# Altium schematic sheet POW.SchDoc
size A4; SheetNumber: 1; SheetTotal: 2
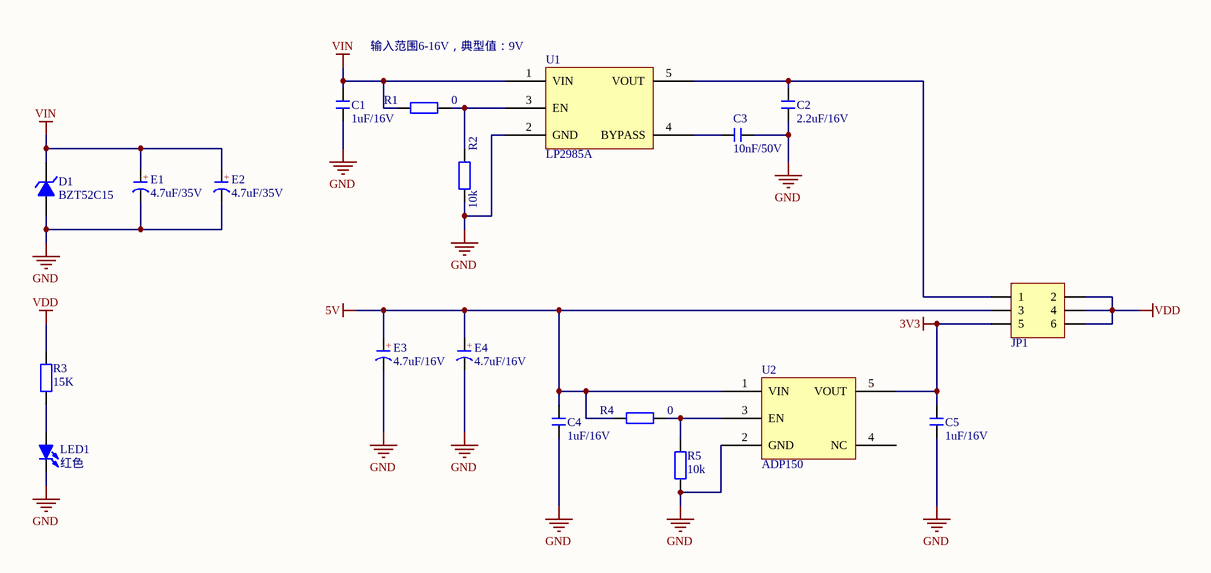
[diagram p0: POW.SchDoc]

## Parts
C1  1uF/16V  [C 0402_L]
C2  2.2uF/16V  [C 0402_L]
C3  10nF/50V  [C 0402_L]
C4  1uF/16V  [C 0402_L]
C5  1uF/16V  [C 0402_L]
D1  BZT52C15  [SOD-123]
E1  4.7uF/35V  [CD E(7343H)]
E2  4.7uF/35V  [CD E(7343H)]
E3  4.7uF/16V  [CD A(3216)]
E4  4.7uF/16V  [CD A(3216)]
JP1  Header3X2  [HDR2.54-LI-2x3P]  (value not drawn)
LED1  红色  [LED]
R1  0  [R 0402_L]
R2  10k  [R 0402_L]
R3  15K  [R 0402_L]
R4  0  [R 0402_L]
R5  10k  [R 0402_L]
U1  LP2985A  [SOT23-5]
U2  ADP150  [SOT23-5]

## Nets
3V3: C5.2 JP1.5 U2.5(VOUT)
5V: C4.2 E3.1(A) E4.1(A) JP1.3 R4.2 U2.1(VIN)
GND: C1.1 C2.1 C3.2 C4.1 C5.1 D1.1(A) E1.2(K) E2.2(K) E3.2(K) E4.2(K) LED1.2(K) R2.2 R5.2 U1.2(GND) U2.2(GND)
VDD: JP1.2 JP1.4 JP1.6 R3.1
VIN: C1.2 D1.2(K) E1.1(A) E2.1(A) R1.2 U1.1(VIN)
NetC2_2: C2.2 JP1.1 U1.5(VOUT)
NetC3_1: C3.1 U1.4(BYPASS)
NetLED1_1: LED1.1(A) R3.2
NetR1_1: R1.1 R2.1 U1.3(EN)
NetR4_1: R4.1 R5.1 U2.3(EN)

Not connected (* = marked no-connect by the designer): U2 4(NC)

## Notes on the sheet
- 输入范围6-16V，典型值：9V
- (in symbol C-CD) +

## Library data of the parts
C1 C4 C5 = C: 贴片电容; 主类型: 电容; 值精度: ±10%; 元件封装: 0402; 具体类型: 陶瓷电容; 封装类型: 贴片; 温度漂移: X5R; 生产商: SAMSUNG(三星); 生产商零件编码: CL05A105KO5NNNC; 值/型号: 1uF/16V; 立创编号: C29266
C2 = C: 贴片电容; 主类型: 电容; 值精度: ±10%; 元件封装: 0402; 具体类型: 陶瓷电容; 封装类型: 贴片; 温度漂移: X5R; 生产商: SAMSUNG(三星); 生产商零件编码: CL05A225KO5NQNC; 值/型号: 2.2uF/16V; 立创编号: C170151
C3 = C: 贴片电容 10nF/50V; 主类型: 电容; 值精度: ±5%; 元件封装: 0402; 具体类型: 陶瓷电容; 封装类型: 贴片; 温度漂移: C0G; 温度范围: -55°C ~ 125°C; 生产商: YAGEO(国巨); 生产商零件编码: CC0402JRX7R9BB103; 值/型号: 10nF/50V; 立创编号: C272878
D1 = IN4735A: 主类型: 二极管; 具体类型: 稳压二极管; 封装类型: 贴片; 生产商: MDD; 值/型号: BZT52C15; 元件封装: SOD-123; 生产商零件编码: BZT52C15; 立创编号: C173427
E1 E2 = C-CD: 聚合物电容 4.7uF/35V; 主类型: 电容; 值精度: ±20%; 元件封装: CASE-D_7343; 封装类型: 贴片; 温度范围: -55℃ ~ +105℃; 生产商: VISHAY(威世); 生产商零件编码: 293D475X0035D2TE3; 值/型号: 4.7uF/35V; 具体类型: 聚合物电容; 立创编号: C215880
E3 E4 = C-CD: 聚合物电容 4.7uF/16V; 主类型: 电容; 值精度: ±20%; 元件封装: CASE-A_3216; 封装类型: 贴片; 温度范围: -55℃ ~ +105℃; 生产商: Sunlord(顺络); 生产商零件编码: TC211A475M016A; 值/型号: 4.7uF/16V; 具体类型: 聚合物电容; 立创编号: C136628
JP1 = Header 3X2: 3*2P接插件; 版权归属: 源创客; BOM名称: 3*2P接插件; 学习资源: www.ooocke.com
LED1 = LED-SMD: C84267
R1 R4 = R: 贴片电阻 0402 1%; 主类型: 电阻; 元件封装: 0402; 封装类型: 贴片; 温度漂移: ±100ppm/℃; 生产商: 国巨; 生产商零件编码: RC0402FR-070RL; 值/型号: 0; 值精度: ±1%; 具体类型: 贴片电阻; 立创编号: C106231
R2 R5 = R: 贴片电阻; 主类型: 电阻; 值精度: ±1%; 元件封装: 0402; 封装类型: 贴片; 温度漂移: ±100ppm/℃; 生产商: YAGEO（国巨）; 生产商零件编码: RC0402FR-0710KL; 值/型号: 10K; 具体类型: 贴片电阻; 立创编号: C60490
R3 = R: 贴片电阻 0402 5%; 主类型: 电阻; 值精度: ±1%; 元件封装: 0402; 封装类型: 贴片; 温度漂移: 50ppm; 生产商: 国巨; 生产商零件编码: RT0402FRE0715KL; 值/型号: 15K; 具体类型: 贴片电阻; 立创编号: C136975
U2 = ADP150: ADP150AUJZ-3.3-R7; 主类型: 电源芯片; 元件封装: SOT-23-5; 具体类型: 线性稳压芯片; 封装类型: 贴片; 生产商: ADI(亚德诺)/LINEAR; 值/型号: ADP150AUJZ-3.3-R7; 生产商零件编码: ADP150AUJZ-3.3-R7; 立创编号: C29149